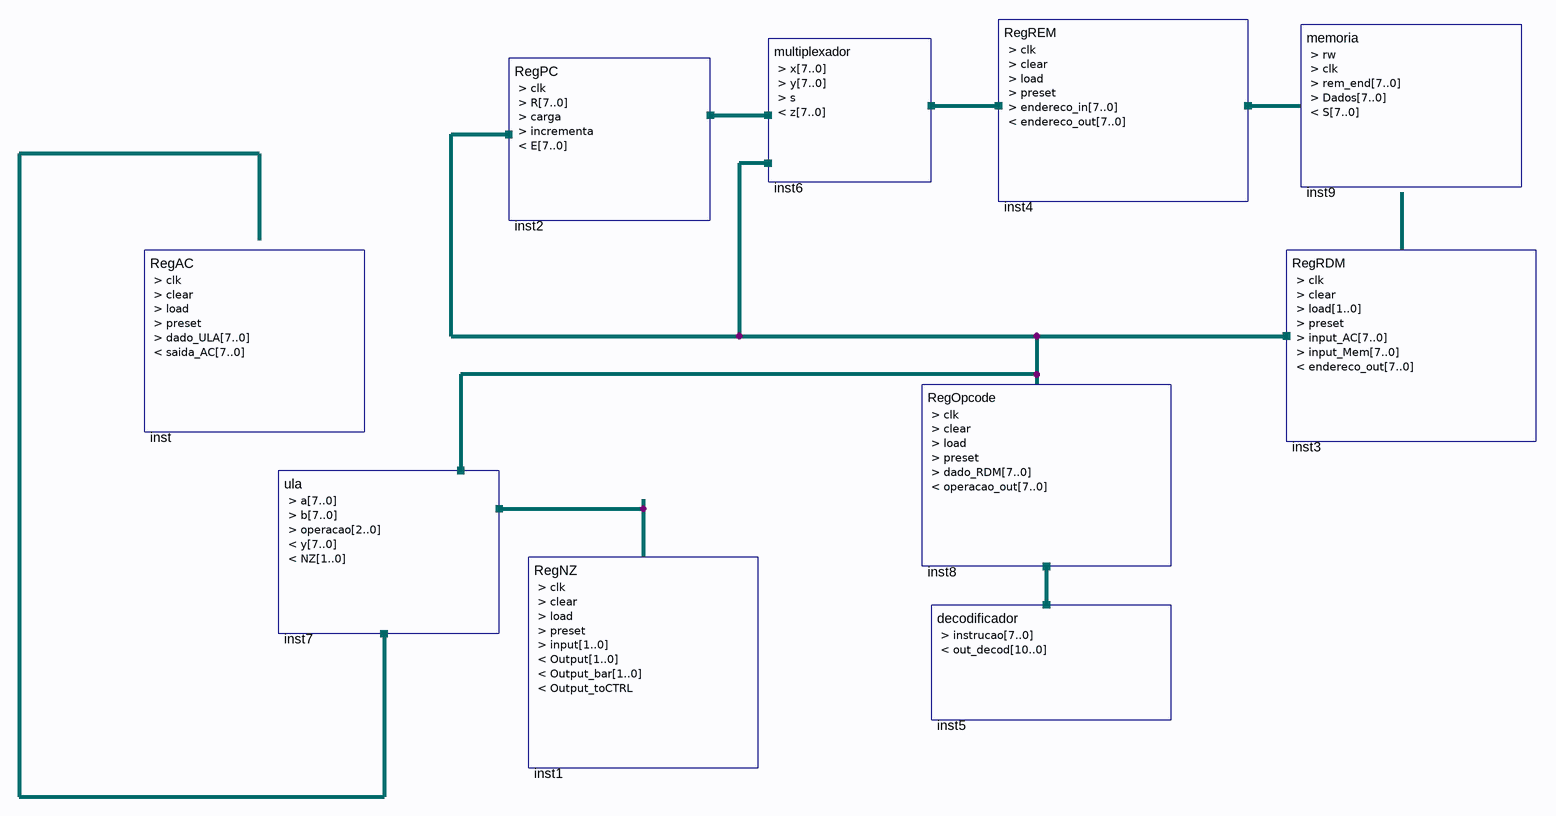
[diagram p0: schematic sheet]
// Quartus schematic NEANDER.bdf as structural Verilog: 10 symbols, 0 pins
module NEANDER (
);

  wire clk;
  wire [7:0] y;

  RegAC inst ();  // open: clk, clear, load, preset, dado_ULA, saida_AC
  ula inst7 (.y(y));  // open: a, b, operacao, NZ
  RegPC inst2 (.clk(clk));  // open: R, carga, incrementa, E
  RegNZ inst1 ();  // open: clk, clear, load, preset, input, Output, Output_bar, Output_toCTRL
  multiplexador inst6 (.y(y));  // open: x, s, z
  RegOpcode inst8 ();  // open: clk, clear, load, preset, dado_RDM, operacao_out
  decodificador inst5 ();  // open: instrucao, out_decod
  RegREM inst4 ();  // open: clk, clear, load, preset, endereco_in, endereco_out
  memoria inst9 ();  // open: rw, clk, rem_end, Dados, S
  RegRDM inst3 (.clk(clk));  // open: clear, load, preset, input_AC, input_Mem, endereco_out
endmodule
